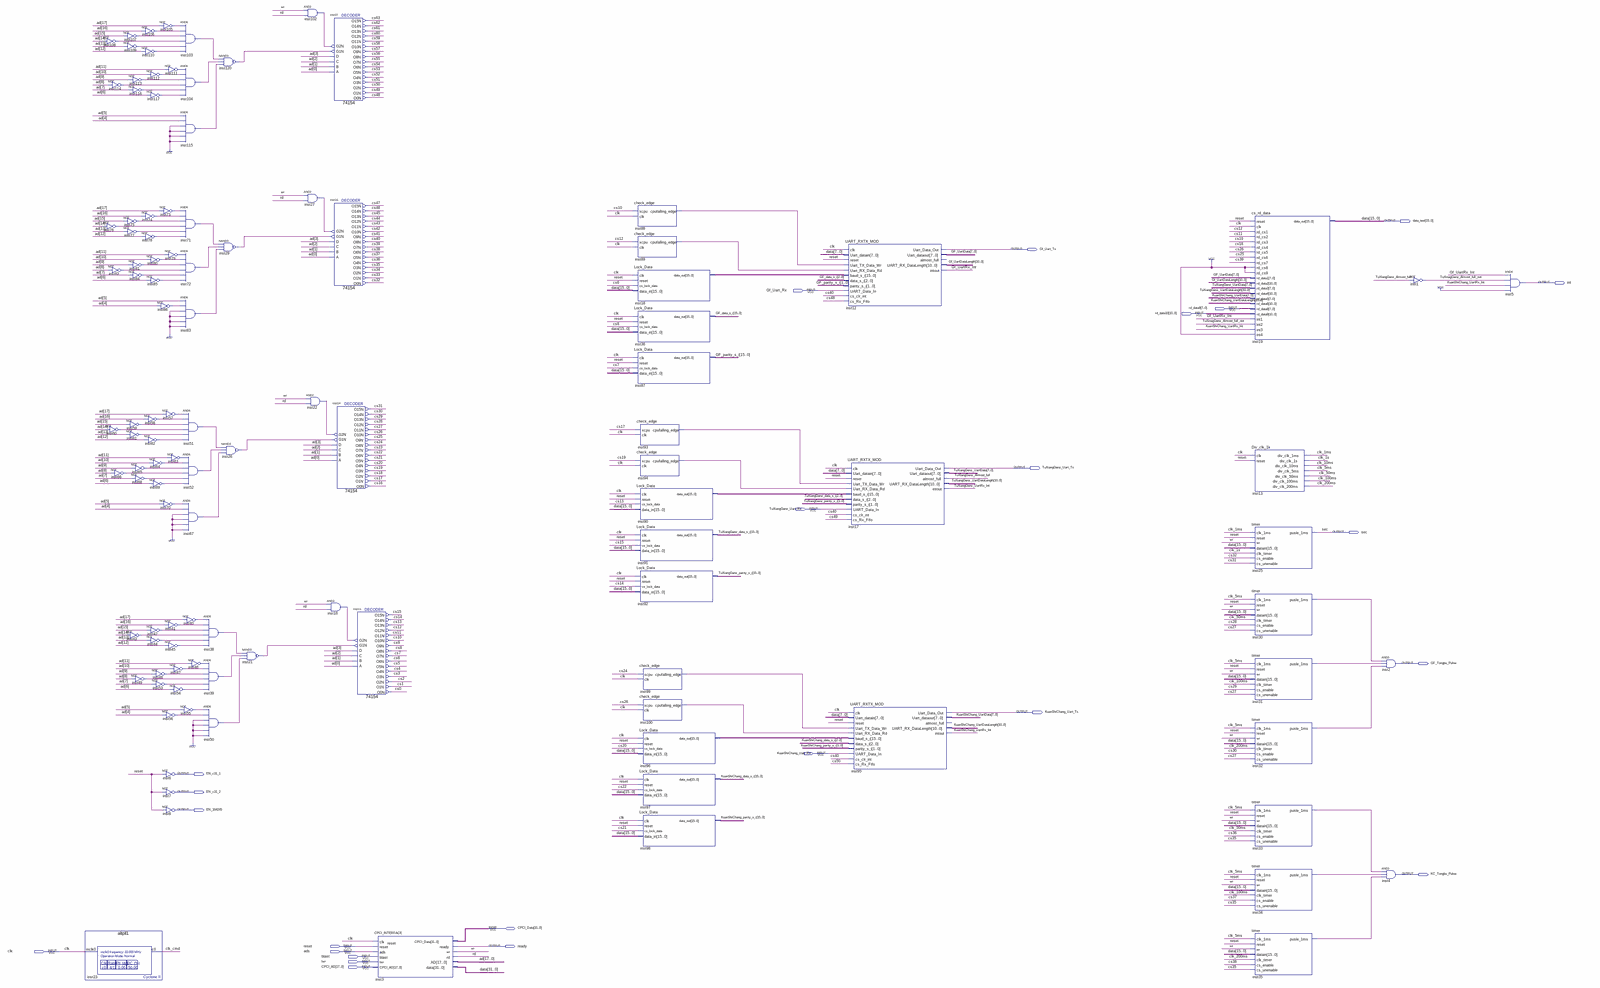
[diagram p0: schematic sheet, whole]
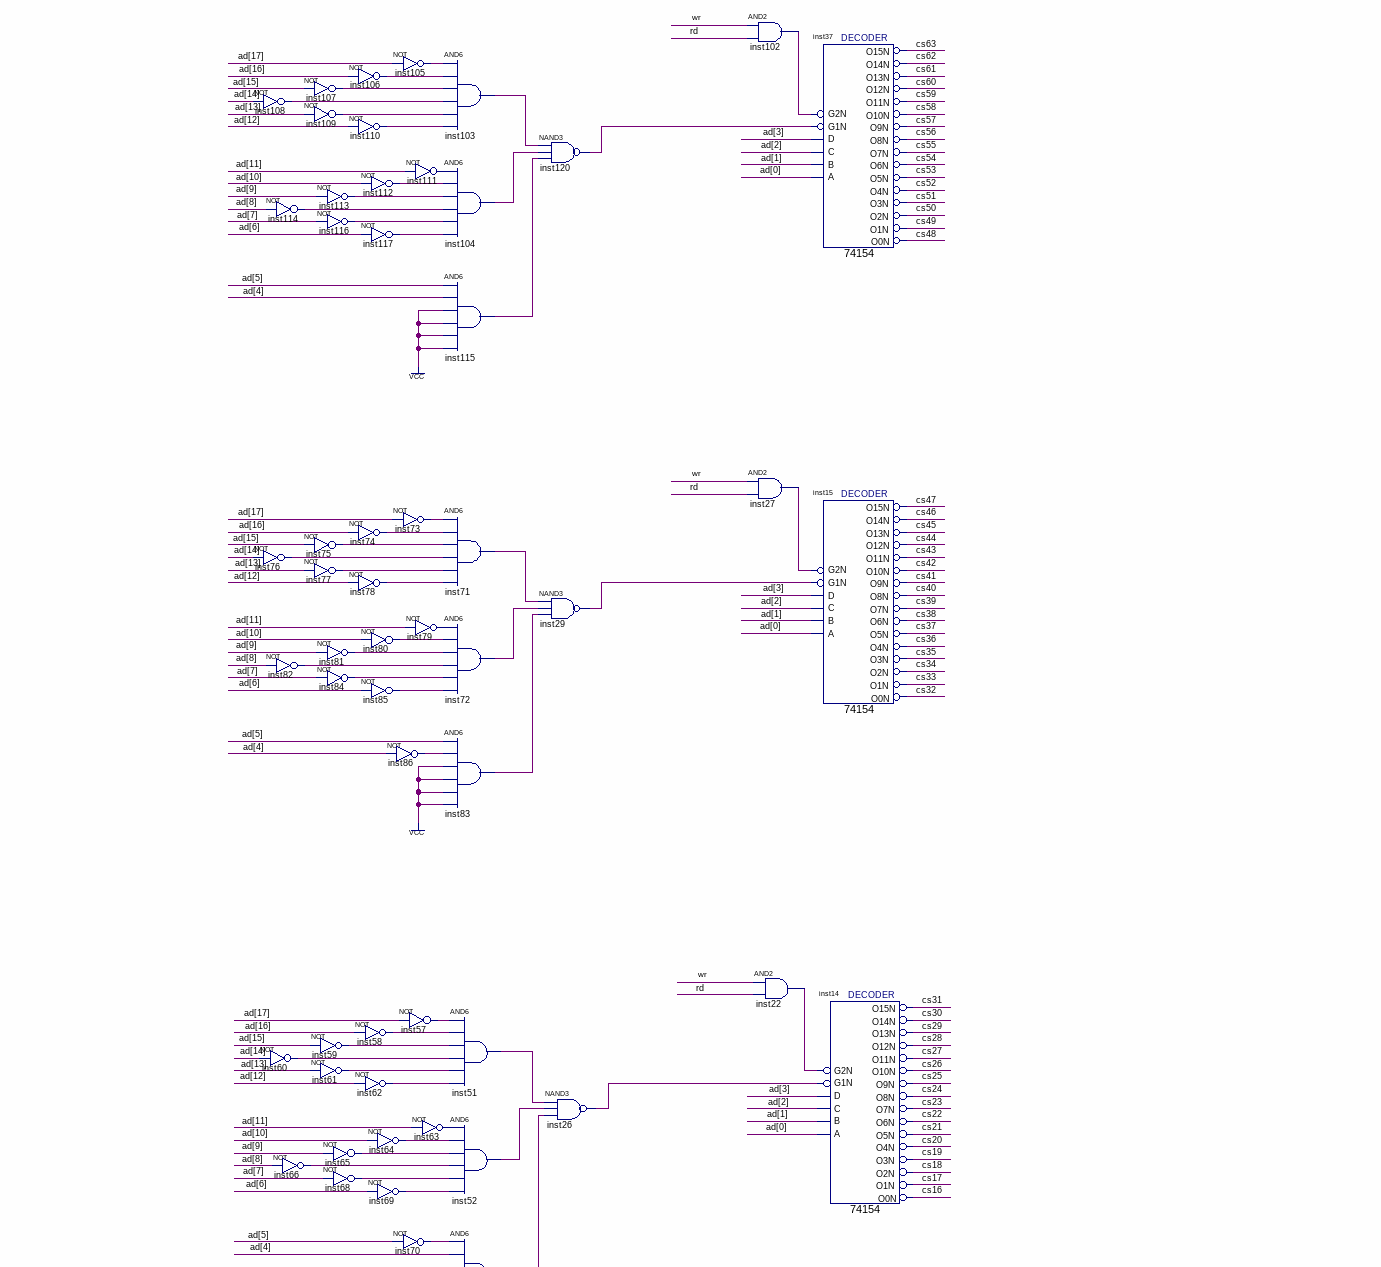
[diagram p1: schematic sheet, upper left part]
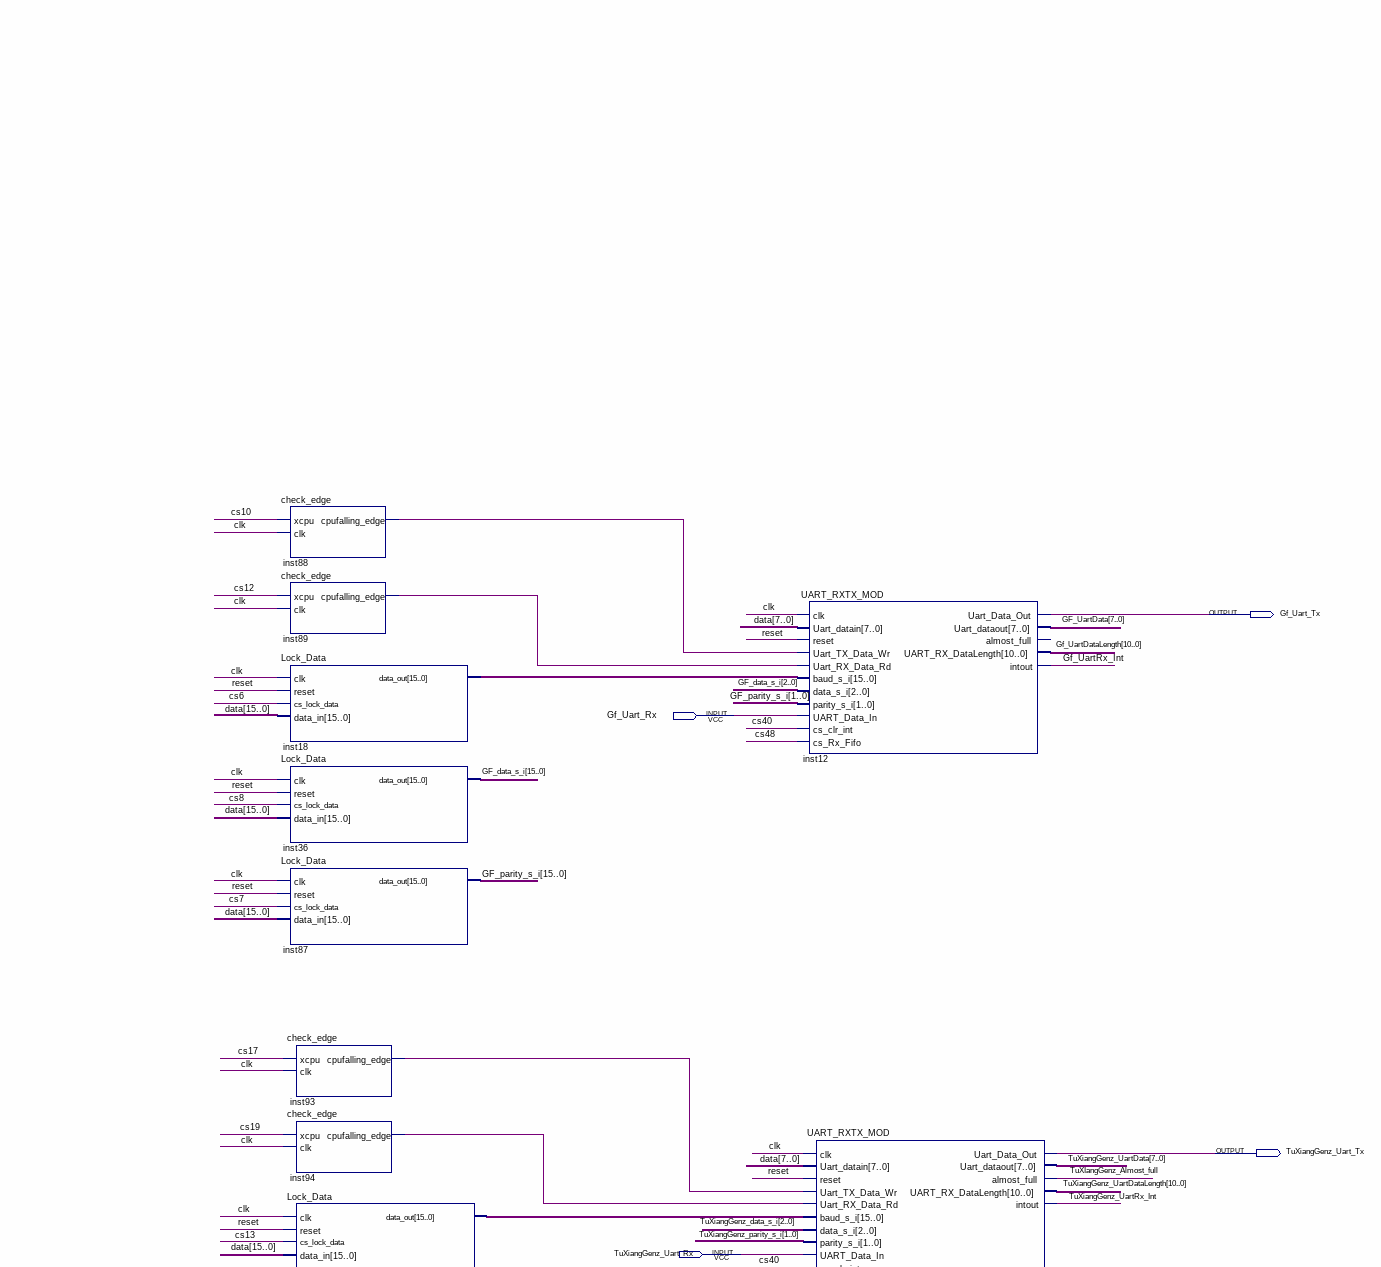
[diagram p2: schematic sheet, upper centre part]
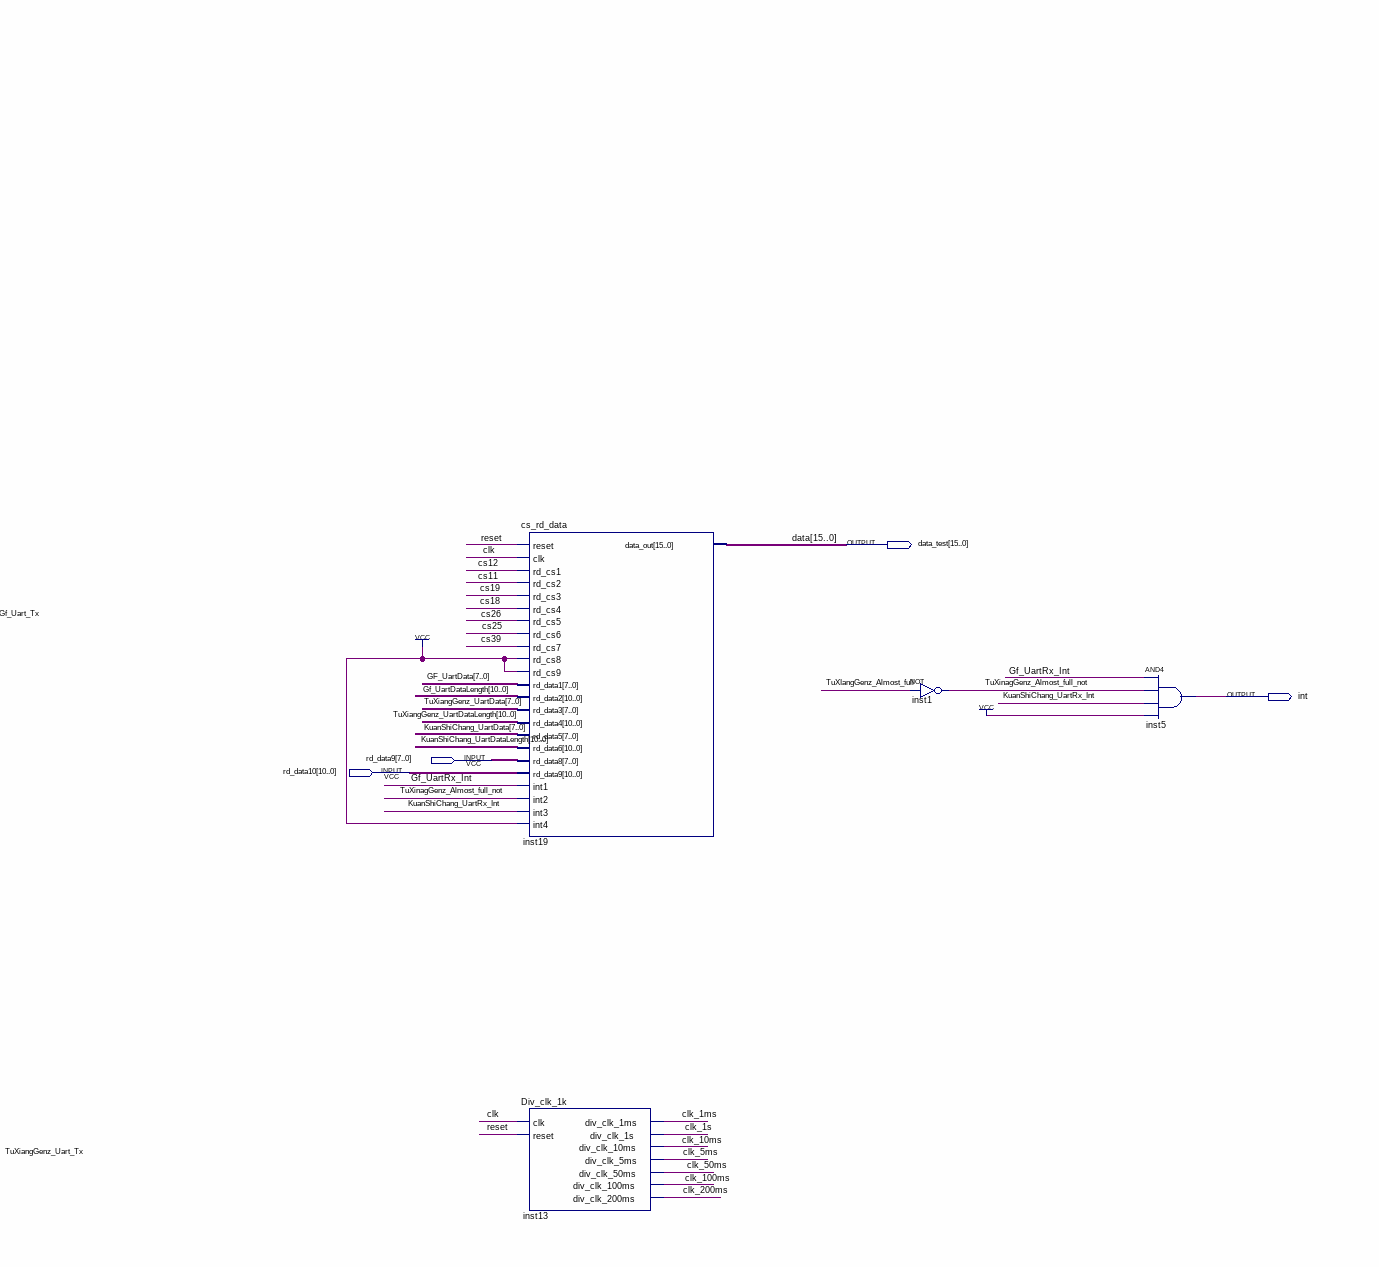
[diagram p3: schematic sheet, upper right part]
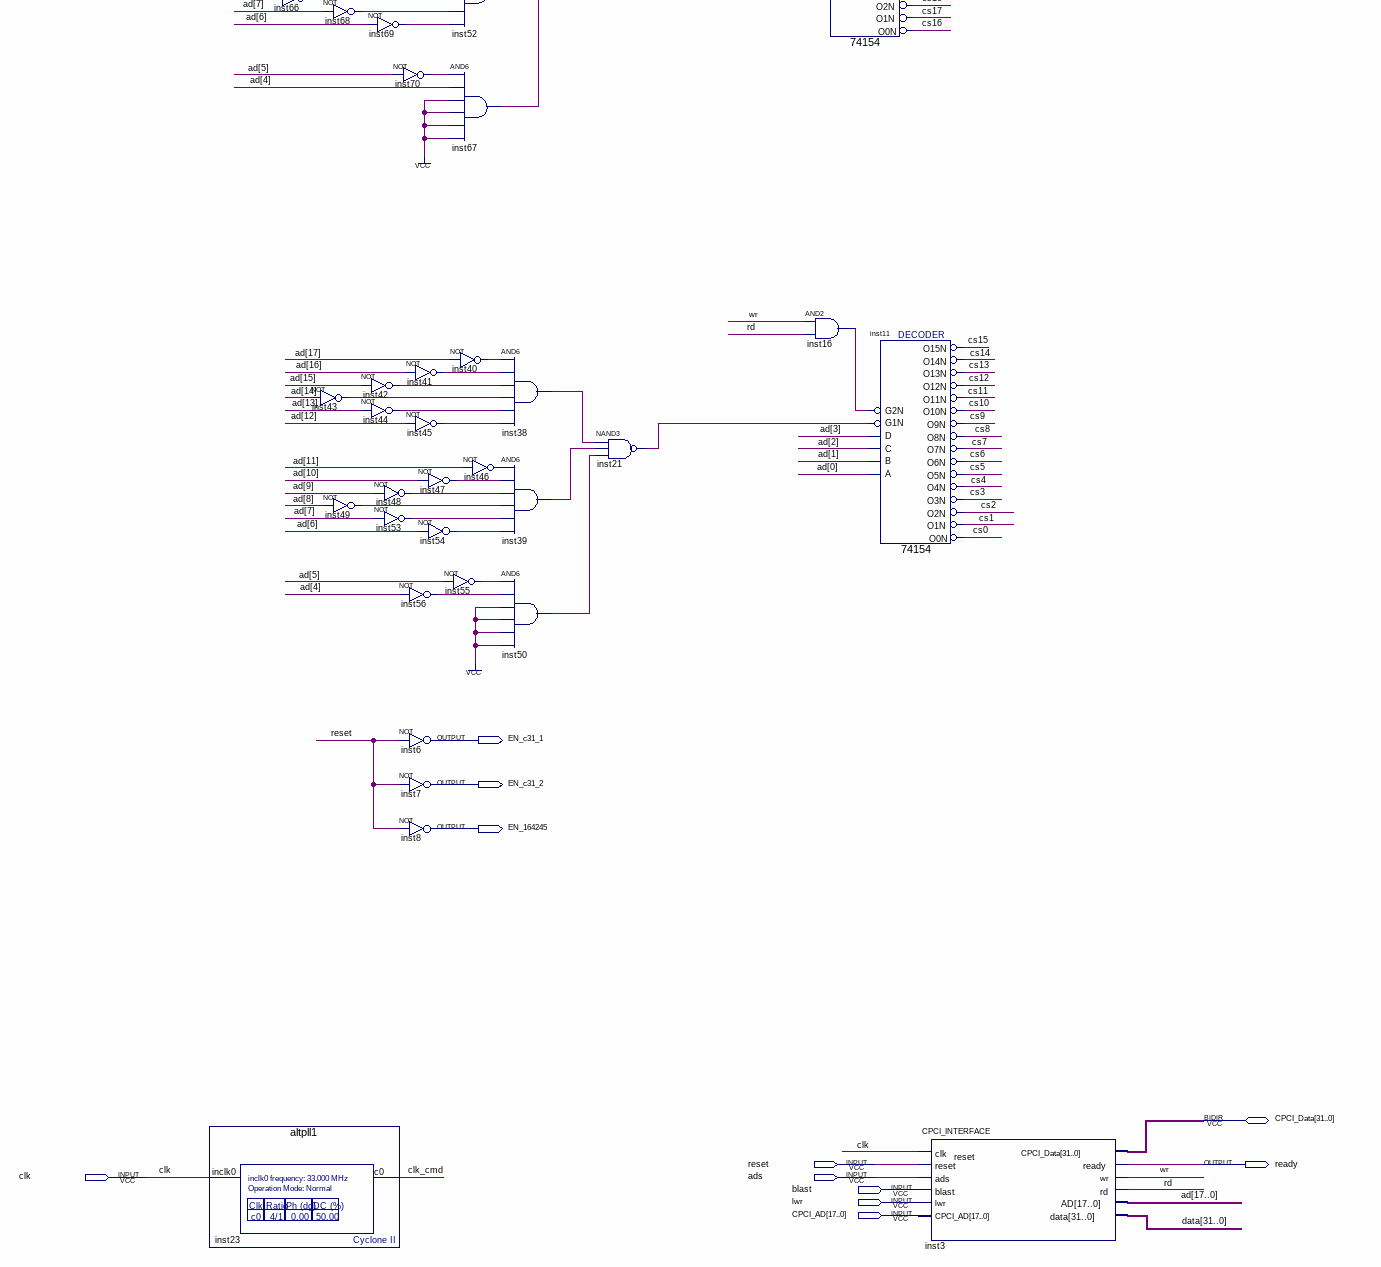
[diagram p4: schematic sheet, lower left part]
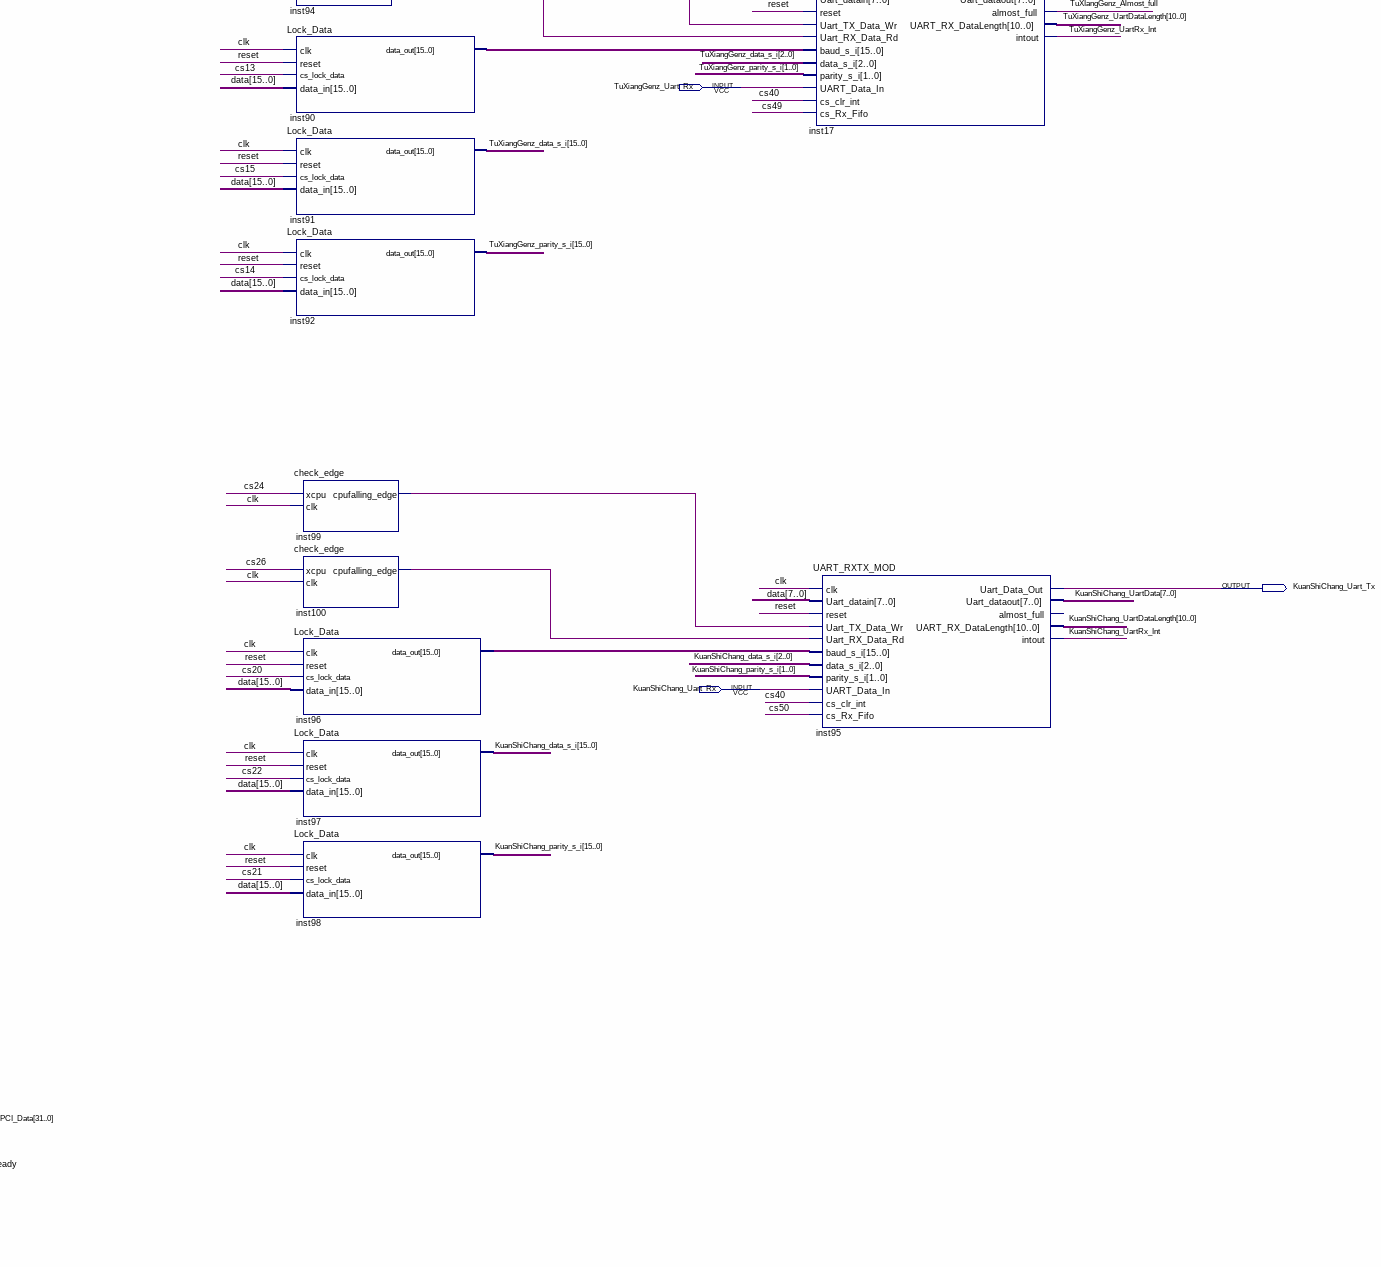
[diagram p5: schematic sheet, lower centre part]
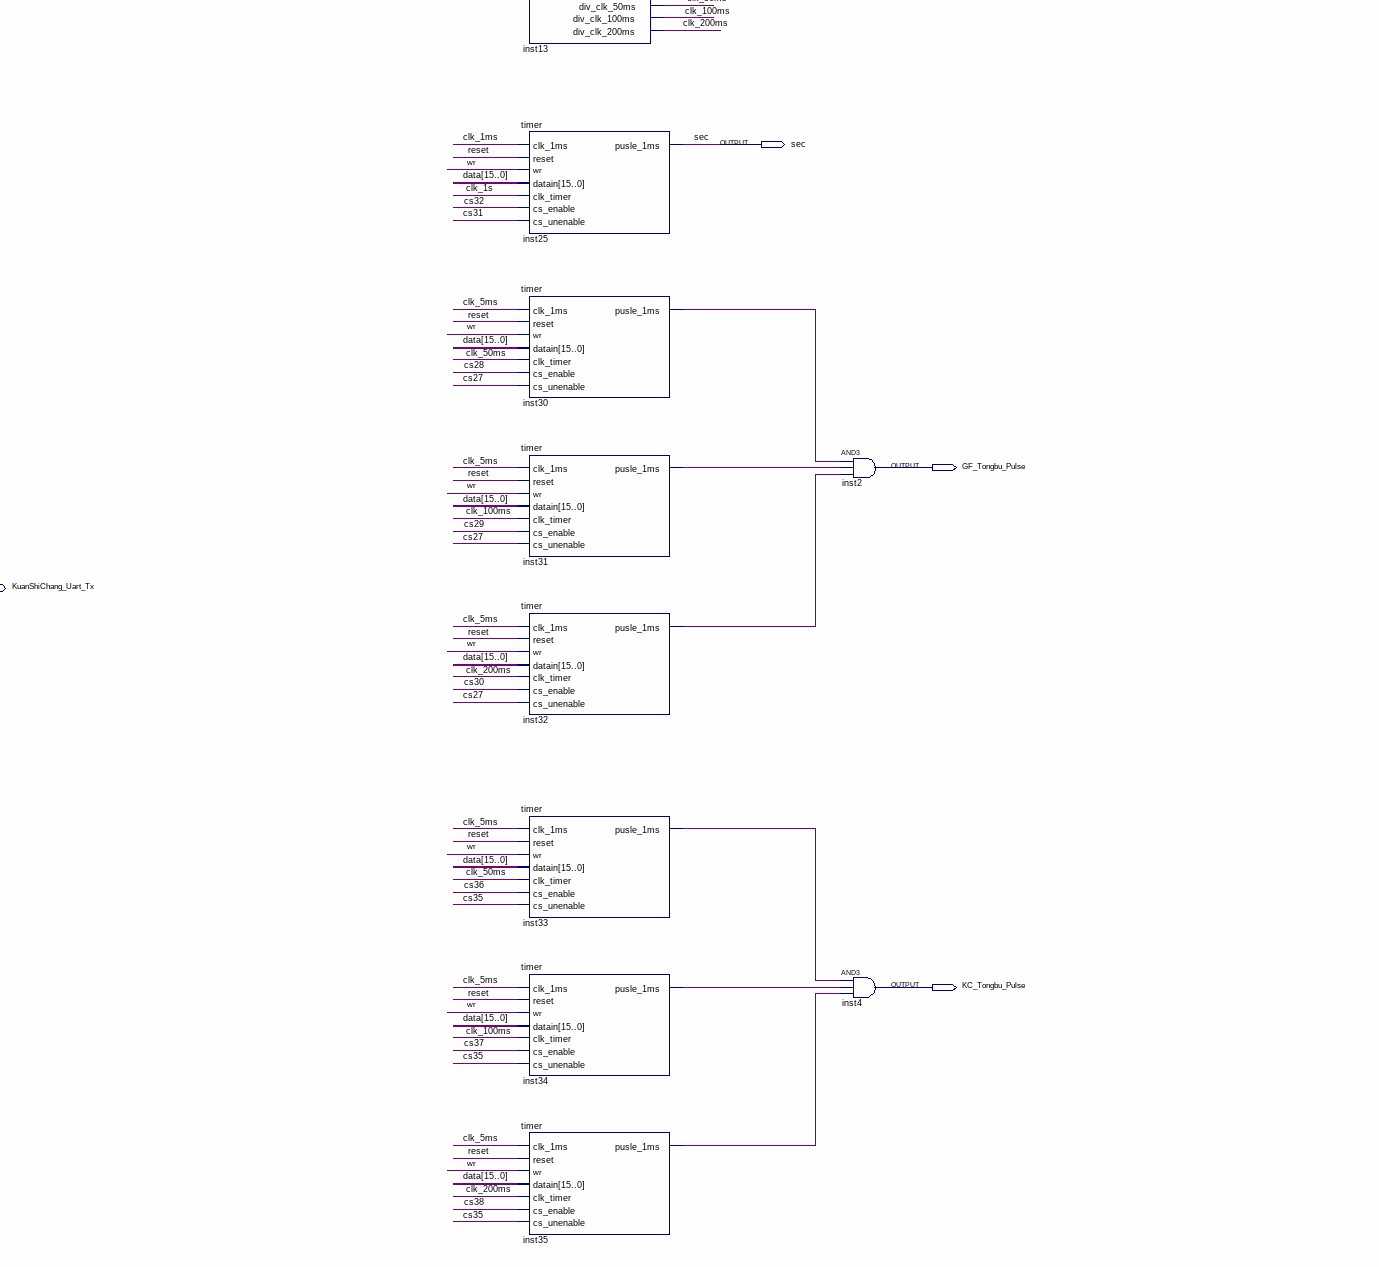
[diagram p6: schematic sheet, lower right part]
// Quartus schematic TMTC_FPGA.bdf as structural Verilog: 112 symbols, 24 pins
module TMTC_FPGA (
  input  Gf_Uart_Rx,
  input  [7:0] rd_data9,
  input  [10:0] rd_data10,
  input  TuXiangGenz_Uart_Rx,
  input  KuanShiChang_Uart_Rx,
  input  reset,
  input  clk,
  input  ads,
  input  blast,
  input  lwr,
  input  [17:0] CPCI_AD,
  inout  [31:0] CPCI_Data,
  output [15:0] data_test,
  output Gf_Uart_Tx,
  output \int ,
  output TuXiangGenz_Uart_Tx,
  output sec,
  output GF_Tongbu_Pulse,
  output KuanShiChang_Uart_Tx,
  output EN_c31_1,
  output EN_c31_2,
  output EN_164245,
  output KC_Tongbu_Pulse,
  output ready
);

  wire clk_1ms, clk_1s, clk_5ms, clk_10ms, clk_50ms, clk_100ms, clk_200ms, clk_cmd, cs0, cs1, cs2, cs3, cs4,
       cs5, cs6, cs7, cs8, cs9, cs10, cs11, cs12, cs13, cs14, cs15, cs16, cs17, cs18, cs19, cs20, cs21, cs22,
       cs23, cs24, cs25, cs26, cs27, cs28, cs29, cs30, cs31, cs32, cs33, cs34, cs35, cs36, cs37, cs38, cs39,
       cs40, cs41, cs42, cs43, cs44, cs45, cs46, cs47, cs48, cs49, cs50, cs51, cs52, cs53, cs54, cs55, cs56,
       cs57, cs58, cs59, cs60, cs61, cs62, cs63, Gf_UartRx_Int, inst16_out, inst21_out, inst22_out,
       inst26_out, inst27_out, inst29_out, inst30_pusle_1ms, inst31_pusle_1ms, inst32_pusle_1ms,
       inst33_pusle_1ms, inst34_pusle_1ms, inst35_pusle_1ms, inst38_out, inst39_out, inst40_out, inst41_out,
       inst42_out, inst43_out, inst44_out, inst45_out, inst46_out, inst47_out, inst48_out, inst49_out,
       inst50_out, inst51_out, inst52_out, inst53_out, inst54_out, inst55_out, inst56_out, inst57_out,
       inst58_out, inst59_out, inst60_out, inst61_out, inst62_out, inst63_out, inst64_out, inst65_out,
       inst66_out, inst67_out, inst68_out, inst69_out, inst70_out, inst71_out, inst72_out, inst73_out,
       inst74_out, inst75_out, inst76_out, inst77_out, inst78_out, inst79_out, inst80_out, inst81_out,
       inst82_out, inst83_out, inst84_out, inst85_out, inst86_out, inst88_cpufalling_edge,
       inst89_cpufalling_edge, inst93_cpufalling_edge, inst94_cpufalling_edge, inst99_cpufalling_edge,
       inst100_cpufalling_edge, inst102_out, inst103_out, inst104_out, inst105_out, inst106_out, inst107_out,
       inst108_out, inst109_out, inst110_out, inst111_out, inst112_out, inst113_out, inst114_out,
       inst115_out, inst116_out, inst117_out, inst120_out, KuanShiChang_UartRx_Int, rd,
       TuXIangGenz_Almost_full, TuXiangGenz_UartRx_Int, TuXinagGenz_Almost_full_not, wr;
  wire [7:0] GF_UartData, KuanShiChang_UartData, TuXiangGenz_UartData;
  wire [10:0] Gf_UartDataLength, KuanShiChang_UartDataLength, TuXiangGenz_UartDataLength;
  wire [15:0] GF_data_s_i, GF_parity_s_i, inst18_data_out, inst90_data_out, inst96_data_out,
       KuanShiChang_data_s_i, KuanShiChang_parity_s_i, TuXiangGenz_data_s_i, TuXiangGenz_parity_s_i;
  wire [17:0] ad;
  wire [31:16] data;

  altpll1 inst23 (.inclk0(clk), .c0(clk_cmd));
  not inst108 (inst108_out, ad[14]);
  not inst76 (inst76_out, ad[14]);
  not inst60 (inst60_out, ad[14]);
  not inst107 (inst107_out, ad[15]);
  not inst109 (inst109_out, ad[13]);
  not inst114 (inst114_out, ad[8]);
  not inst75 (inst75_out, ad[15]);
  not inst77 (inst77_out, ad[13]);
  not inst82 (inst82_out, ad[8]);
  not inst59 (inst59_out, ad[15]);
  not inst61 (inst61_out, ad[13]);
  not inst66 (inst66_out, ad[8]);
  not inst43 (inst43_out, ad[14]);
  not inst106 (inst106_out, ad[16]);
  not inst110 (inst110_out, ad[12]);
  not inst112 (inst112_out, ad[10]);
  not inst113 (inst113_out, ad[9]);
  not inst116 (inst116_out, ad[7]);
  not inst117 (inst117_out, ad[6]);
  not inst74 (inst74_out, ad[16]);
  not inst78 (inst78_out, ad[12]);
  not inst80 (inst80_out, ad[10]);
  not inst81 (inst81_out, ad[9]);
  not inst84 (inst84_out, ad[7]);
  not inst85 (inst85_out, ad[6]);
  not inst58 (inst58_out, ad[16]);
  not inst62 (inst62_out, ad[12]);
  not inst65 (inst65_out, ad[9]);
  not inst68 (inst68_out, ad[7]);
  not inst42 (inst42_out, ad[15]);
  not inst44 (inst44_out, ad[13]);
  not inst49 (inst49_out, ad[8]);
  not inst105 (inst105_out, ad[17]);
  not inst111 (inst111_out, ad[11]);
  not inst73 (inst73_out, ad[17]);
  not inst79 (inst79_out, ad[11]);
  not inst86 (inst86_out, ad[4]);
  not inst57 (inst57_out, ad[17]);
  not inst63 (inst63_out, ad[11]);
  not inst64 (inst64_out, ad[10]);
  not inst69 (inst69_out, ad[6]);
  not inst70 (inst70_out, ad[5]);
  not inst41 (inst41_out, ad[16]);
  not inst45 (inst45_out, ad[12]);
  not inst48 (inst48_out, ad[9]);
  not inst53 (inst53_out, ad[7]);
  not inst56 (inst56_out, ad[4]);
  not inst6 (EN_c31_1, reset);
  not inst7 (EN_c31_2, reset);
  not inst8 (EN_164245, reset);
  and inst103 (inst103_out, inst105_out, inst106_out, inst107_out, inst108_out, inst109_out, inst110_out);
  and inst104 (inst104_out, inst111_out, inst112_out, inst113_out, inst114_out, inst116_out, inst117_out);
  and inst115 (inst115_out, ad[5], ad[4], 1'b1, 1'b1, 1'b1, 1'b1);
  and inst71 (inst71_out, inst73_out, inst74_out, inst75_out, inst76_out, inst77_out, inst78_out);
  and inst72 (inst72_out, inst79_out, inst80_out, inst81_out, inst82_out, inst84_out, inst85_out);
  and inst83 (inst83_out, ad[5], inst86_out, 1'b1, 1'b1, 1'b1, 1'b1);
  and inst51 (inst51_out, inst57_out, inst58_out, inst59_out, inst60_out, inst61_out, inst62_out);
  and inst52 (inst52_out, inst63_out, inst64_out, inst65_out, inst66_out, inst68_out, inst69_out);
  and inst67 (inst67_out, inst70_out, ad[4], 1'b1, 1'b1, 1'b1, 1'b1);
  not inst40 (inst40_out, ad[17]);
  not inst46 (inst46_out, ad[11]);
  not inst47 (inst47_out, ad[10]);
  not inst54 (inst54_out, ad[6]);
  not inst55 (inst55_out, ad[5]);
  and inst38 (inst38_out, inst40_out, inst41_out, inst42_out, inst43_out, inst44_out, inst45_out);
  and inst39 (inst39_out, inst46_out, inst47_out, inst48_out, inst49_out, inst53_out, inst54_out);
  and inst50 (inst50_out, inst55_out, inst56_out, 1'b1, 1'b1, 1'b1, 1'b1);
  nand inst120 (inst120_out, inst103_out, inst104_out, inst115_out);
  nand inst29 (inst29_out, inst71_out, inst72_out, inst83_out);
  nand inst26 (inst26_out, inst51_out, inst52_out, inst67_out);
  nand inst21 (inst21_out, inst38_out, inst39_out, inst50_out);
  and inst102 (inst102_out, wr, rd);
  and inst27 (inst27_out, wr, rd);
  and inst22 (inst22_out, wr, rd);
  \74154  inst37 (
    .C(ad[2]), .D(ad[3]), .B(ad[1]), .A(ad[0]), .G1N(inst120_out), .G2N(inst102_out), .O0N(cs48),
    .O12N(cs60), .O15N(cs63), .O10N(cs58), .O11N(cs59), .O1N(cs49), .O13N(cs61), .O14N(cs62), .O4N(cs52),
    .O3N(cs51), .O2N(cs50), .O7N(cs55), .O6N(cs54), .O5N(cs53), .O9N(cs57), .O8N(cs56));
  \74154  inst15 (
    .C(ad[2]), .D(ad[3]), .B(ad[1]), .A(ad[0]), .G1N(inst29_out), .G2N(inst27_out), .O0N(cs32), .O12N(cs44),
    .O15N(cs47), .O10N(cs42), .O11N(cs43), .O1N(cs33), .O13N(cs45), .O14N(cs46), .O4N(cs36), .O3N(cs35),
    .O2N(cs34), .O7N(cs39), .O6N(cs38), .O5N(cs37), .O9N(cs41), .O8N(cs40));
  \74154  inst14 (
    .C(ad[2]), .D(ad[3]), .B(ad[1]), .A(ad[0]), .G1N(inst26_out), .G2N(inst22_out), .O0N(cs16), .O12N(cs28),
    .O15N(cs31), .O10N(cs26), .O11N(cs27), .O1N(cs17), .O13N(cs29), .O14N(cs30), .O4N(cs20), .O3N(cs19),
    .O2N(cs18), .O7N(cs23), .O6N(cs22), .O5N(cs21), .O9N(cs25), .O8N(cs24));
  and inst16 (inst16_out, wr, rd);
  \74154  inst11 (
    .C(ad[2]), .D(ad[3]), .B(ad[1]), .A(ad[0]), .G1N(inst21_out), .G2N(inst16_out), .O0N(cs0), .O12N(cs12),
    .O15N(cs15), .O10N(cs10), .O11N(cs11), .O1N(cs1), .O13N(cs13), .O14N(cs14), .O4N(cs4), .O3N(cs3),
    .O2N(cs2), .O7N(cs7), .O6N(cs6), .O5N(cs5), .O9N(cs9), .O8N(cs8));
  CPCI_INTERFACE inst3 (
    .clk(clk), .reset(reset), .ads(ads), .blast(blast), .lwr(lwr), .CPCI_AD(CPCI_AD), .ready(ready), .wr(wr),
    .rd(rd), .AD(ad), .CPCI_Data(CPCI_Data), .data({data, data_test}));
  check_edge inst88 (.xcpu(cs10), .clk(clk), .cpufalling_edge(inst88_cpufalling_edge));
  check_edge inst89 (.xcpu(cs12), .clk(clk), .cpufalling_edge(inst89_cpufalling_edge));
  Lock_Data inst18 (.clk(clk), .reset(reset), .cs_lock_data(cs6), .data_in(data_test), .data_out(inst18_data_out));
  Lock_Data inst36 (.clk(clk), .reset(reset), .cs_lock_data(cs8), .data_in(data_test), .data_out(GF_data_s_i));
  Lock_Data inst87 (.clk(clk), .reset(reset), .cs_lock_data(cs7), .data_in(data_test), .data_out(GF_parity_s_i));
  check_edge inst93 (.xcpu(cs17), .clk(clk), .cpufalling_edge(inst93_cpufalling_edge));
  check_edge inst94 (.xcpu(cs19), .clk(clk), .cpufalling_edge(inst94_cpufalling_edge));
  Lock_Data inst90 (.clk(clk), .reset(reset), .cs_lock_data(cs13), .data_in(data_test), .data_out(inst90_data_out));
  Lock_Data inst91 (
    .clk(clk), .reset(reset), .cs_lock_data(cs15), .data_in(data_test), .data_out(TuXiangGenz_data_s_i));
  Lock_Data inst92 (
    .clk(clk), .reset(reset), .cs_lock_data(cs14), .data_in(data_test), .data_out(TuXiangGenz_parity_s_i));
  check_edge inst99 (.xcpu(cs24), .clk(clk), .cpufalling_edge(inst99_cpufalling_edge));
  check_edge inst100 (.xcpu(cs26), .clk(clk), .cpufalling_edge(inst100_cpufalling_edge));
  Lock_Data inst96 (.clk(clk), .reset(reset), .cs_lock_data(cs20), .data_in(data_test), .data_out(inst96_data_out));
  Lock_Data inst97 (
    .clk(clk), .reset(reset), .cs_lock_data(cs22), .data_in(data_test), .data_out(KuanShiChang_data_s_i));
  Lock_Data inst98 (
    .clk(clk), .reset(reset), .cs_lock_data(cs21), .data_in(data_test), .data_out(KuanShiChang_parity_s_i));
  UART_RXTX_MOD inst12 (
    .clk(clk), .Uart_datain(data_test[7:0]), .reset(reset), .Uart_TX_Data_Wr(inst88_cpufalling_edge),
    .Uart_RX_Data_Rd(inst89_cpufalling_edge), .baud_s_i(inst18_data_out), .data_s_i(GF_data_s_i[2:0]),
    .parity_s_i(GF_parity_s_i[1:0]), .UART_Data_In(Gf_Uart_Rx), .cs_clr_int(cs40), .cs_Rx_Fifo(cs48),
    .Uart_Data_Out(Gf_Uart_Tx), .Uart_dataout(GF_UartData), .UART_RX_DataLength(Gf_UartDataLength),
    .intout(Gf_UartRx_Int));  // open: almost_full
  UART_RXTX_MOD inst17 (
    .clk(clk), .Uart_datain(data_test[7:0]), .reset(reset), .Uart_TX_Data_Wr(inst93_cpufalling_edge),
    .Uart_RX_Data_Rd(inst94_cpufalling_edge), .baud_s_i(inst90_data_out),
    .data_s_i(TuXiangGenz_data_s_i[2:0]), .parity_s_i(TuXiangGenz_parity_s_i[1:0]),
    .UART_Data_In(TuXiangGenz_Uart_Rx), .cs_clr_int(cs40), .cs_Rx_Fifo(cs49),
    .Uart_Data_Out(TuXiangGenz_Uart_Tx), .Uart_dataout(TuXiangGenz_UartData),
    .almost_full(TuXIangGenz_Almost_full), .UART_RX_DataLength(TuXiangGenz_UartDataLength),
    .intout(TuXiangGenz_UartRx_Int));
  UART_RXTX_MOD inst95 (
    .clk(clk), .Uart_datain(data_test[7:0]), .reset(reset), .Uart_TX_Data_Wr(inst99_cpufalling_edge),
    .Uart_RX_Data_Rd(inst100_cpufalling_edge), .baud_s_i(inst96_data_out),
    .data_s_i(KuanShiChang_data_s_i[2:0]), .parity_s_i(KuanShiChang_parity_s_i[1:0]),
    .UART_Data_In(KuanShiChang_Uart_Rx), .cs_clr_int(cs40), .cs_Rx_Fifo(cs50),
    .Uart_Data_Out(KuanShiChang_Uart_Tx), .Uart_dataout(KuanShiChang_UartData),
    .UART_RX_DataLength(KuanShiChang_UartDataLength), .intout(KuanShiChang_UartRx_Int));  // open: almost_full
  cs_rd_data inst19 (
    .reset(reset), .clk(clk), .rd_cs1(cs12), .rd_cs2(cs11), .rd_cs3(cs19), .rd_cs4(cs18), .rd_cs5(cs26),
    .rd_cs6(cs25), .rd_cs7(cs39), .rd_cs8(1'b1), .rd_cs9(1'b1), .rd_data1(GF_UartData),
    .rd_data2(Gf_UartDataLength), .rd_data3(TuXiangGenz_UartData), .rd_data4(TuXiangGenz_UartDataLength),
    .rd_data5(KuanShiChang_UartData), .rd_data6(KuanShiChang_UartDataLength), .rd_data8(rd_data9),
    .rd_data9(rd_data10), .int1(Gf_UartRx_Int), .int2(TuXinagGenz_Almost_full_not),
    .int3(KuanShiChang_UartRx_Int), .int4(1'b1), .data_out(data_test));
  Div_clk_1k inst13 (
    .clk(clk), .reset(reset), .div_clk_1ms(clk_1ms), .div_clk_1s(clk_1s), .div_clk_10ms(clk_10ms),
    .div_clk_5ms(clk_5ms), .div_clk_50ms(clk_50ms), .div_clk_100ms(clk_100ms), .div_clk_200ms(clk_200ms));
  timer inst25 (
    .clk_1ms(clk_1ms), .reset(reset), .wr(wr), .datain(data_test), .clk_timer(clk_1s), .cs_enable(cs32),
    .cs_unenable(cs31), .pusle_1ms(sec));
  timer inst30 (
    .clk_1ms(clk_5ms), .reset(reset), .wr(wr), .datain(data_test), .clk_timer(clk_50ms), .cs_enable(cs28),
    .cs_unenable(cs27), .pusle_1ms(inst30_pusle_1ms));
  timer inst31 (
    .clk_1ms(clk_5ms), .reset(reset), .wr(wr), .datain(data_test), .clk_timer(clk_100ms), .cs_enable(cs29),
    .cs_unenable(cs27), .pusle_1ms(inst31_pusle_1ms));
  timer inst32 (
    .clk_1ms(clk_5ms), .reset(reset), .wr(wr), .datain(data_test), .clk_timer(clk_200ms), .cs_enable(cs30),
    .cs_unenable(cs27), .pusle_1ms(inst32_pusle_1ms));
  timer inst33 (
    .clk_1ms(clk_5ms), .reset(reset), .wr(wr), .datain(data_test), .clk_timer(clk_50ms), .cs_enable(cs36),
    .cs_unenable(cs35), .pusle_1ms(inst33_pusle_1ms));
  timer inst34 (
    .clk_1ms(clk_5ms), .reset(reset), .wr(wr), .datain(data_test), .clk_timer(clk_100ms), .cs_enable(cs37),
    .cs_unenable(cs35), .pusle_1ms(inst34_pusle_1ms));
  timer inst35 (
    .clk_1ms(clk_5ms), .reset(reset), .wr(wr), .datain(data_test), .clk_timer(clk_200ms), .cs_enable(cs38),
    .cs_unenable(cs35), .pusle_1ms(inst35_pusle_1ms));
  and inst2 (GF_Tongbu_Pulse, inst30_pusle_1ms, inst31_pusle_1ms, inst32_pusle_1ms);
  and inst4 (KC_Tongbu_Pulse, inst33_pusle_1ms, inst34_pusle_1ms, inst35_pusle_1ms);
  not inst1 (TuXinagGenz_Almost_full_not, TuXIangGenz_Almost_full);
  and inst5 (\int , Gf_UartRx_Int, TuXinagGenz_Almost_full_not, KuanShiChang_UartRx_Int, 1'b1);

  // Other names for the same wires on the sheet: data[15:0] = data_test
endmodule
